# Altium schematic sheet MCU.SchDoc
size A4
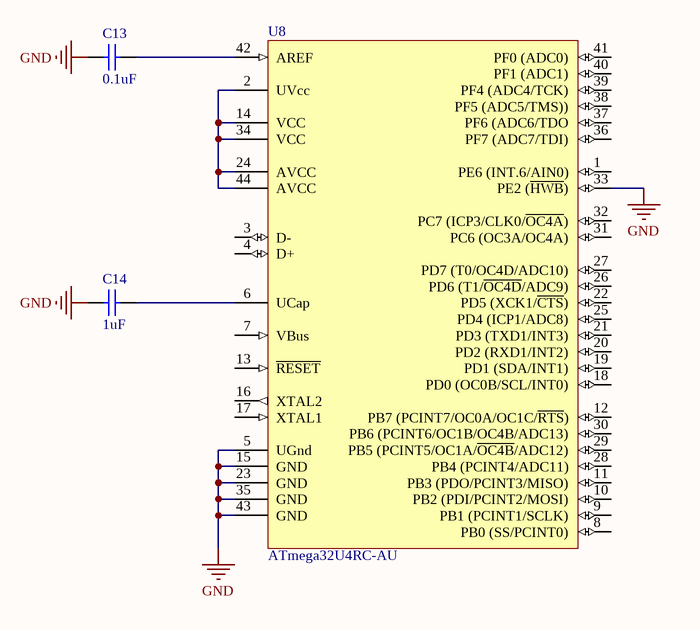
[diagram p0: MCU.SchDoc]

## Parts
C13  value 0.1uF  [1608[0603]]  (hidden comment: Cap Semi)
C14  value 1uF  [1608[0603]]  (hidden comment: Cap Semi)
U8  ATmega32U4RC-AU  [44ML_N]

## Nets
GND: C13.1 C14.1 U8.5(UGnd) U8.15(GND) U8.23(GND) U8.33(PE2_(~{HWB})) U8.35(GND) U8.43(GND)
NetC13_2: C13.2 U8.42(AREF)
NetC14_2: C14.2 U8.6(UCap)
NetU8_2: U8.2(UVcc) U8.14(VCC) U8.24(AVCC) U8.34(VCC) U8.44(AVCC)

Not connected (* = marked no-connect by the designer): U8 1(PE6_(INT.6/AIN0)) 3(D-) 4(D+) 7(VBus) 8(PB0_(SS/PCINT0)) 9(PB1_(PCINT1/SCLK)) 10(PB2_(PDI/PCINT2/MOSI)) 11(PB3_(PDO/PCINT3/MISO)) 12(PB7_(PCINT7/OC0A/OC1C/~{RTS})) 13(~{RESET}) 16(XTAL2) 17(XTAL1) 18(PD0_(OC0B/SCL/INT0)) 19(PD1_(SDA/INT1)) 20(PD2_(RXD1/INT2)) 21(PD3_(TXD1/INT3)) 22(PD5_(XCK1/~{CTS})) 25(PD4_(ICP1/ADC8)) 26(PD6_(T1/~{OC4D}/ADC9)) 27(PD7_(T0/OC4D/ADC10)) 28(PB4_(PCINT4/ADC11)) 29(PB5_(PCINT5/OC1A/~{OC4B}/ADC12)) 30(PB6_(PCINT6/OC1B/OC4B/ADC13)) 31(PC6_(OC3A/OC4A)) 32(PC7_(ICP3/CLK0/~{OC4A})) 36(PF7_(ADC7/TDI)) 37(PF6_(ADC6/TDO) 38(PF5_(ADC5/TMS))) 39(PF4_(ADC4/TCK)) 40(PF1_(ADC1)) 41(PF0_(ADC0))

## Library data of the parts
C13 C14 = Cap Semi: Capacitor (Semiconductor SIM Model); Published: 8-Jun-2000; LatestRevisionDate: 29-May-2009; LatestRevisionNote: IPC-7351 Footprint Added.; PackageReference: C1206; Publisher: Altium Limited; PackageDescription: Chip Capacitor
U8 = CMP-0095-00580-1: 8-bit AVR Microcontroller, 2.7-5.5V, 16MHz, 32KB Flash, 1KB EEPROM, 2.5KB SRAM, USB Controller, 44-pin TQFP, Industrial Grade (-40°C to 85°C), Int RC; PackageVersion: rev.G, Jul-2007; ComponentLink1URL: http://www.atmel.com/; ComponentLink2URL: http://www.atmel.com/dyn/resources/prod_documents/doc7766.pdf; PackageReference: 44ML; ComponentLink2Description: ATmega16U4/32U4 Datasheet; PackageDescription: 44-Pin Plastic Thin Quad Flat Pack, 10 x 10 x 1.0 mm Body, 0.8 mm Pitch (TQFP); ComponentLink3URL: http://www.atmel.com/dyn/resources/prod_documents/7766S.pdf; ComponentLink1Description: Manufacturer URL; DatasheetVersion: revF, Nov-2010; ComponentLink3Description: ATmega16U4 ATmega32U4 Summary